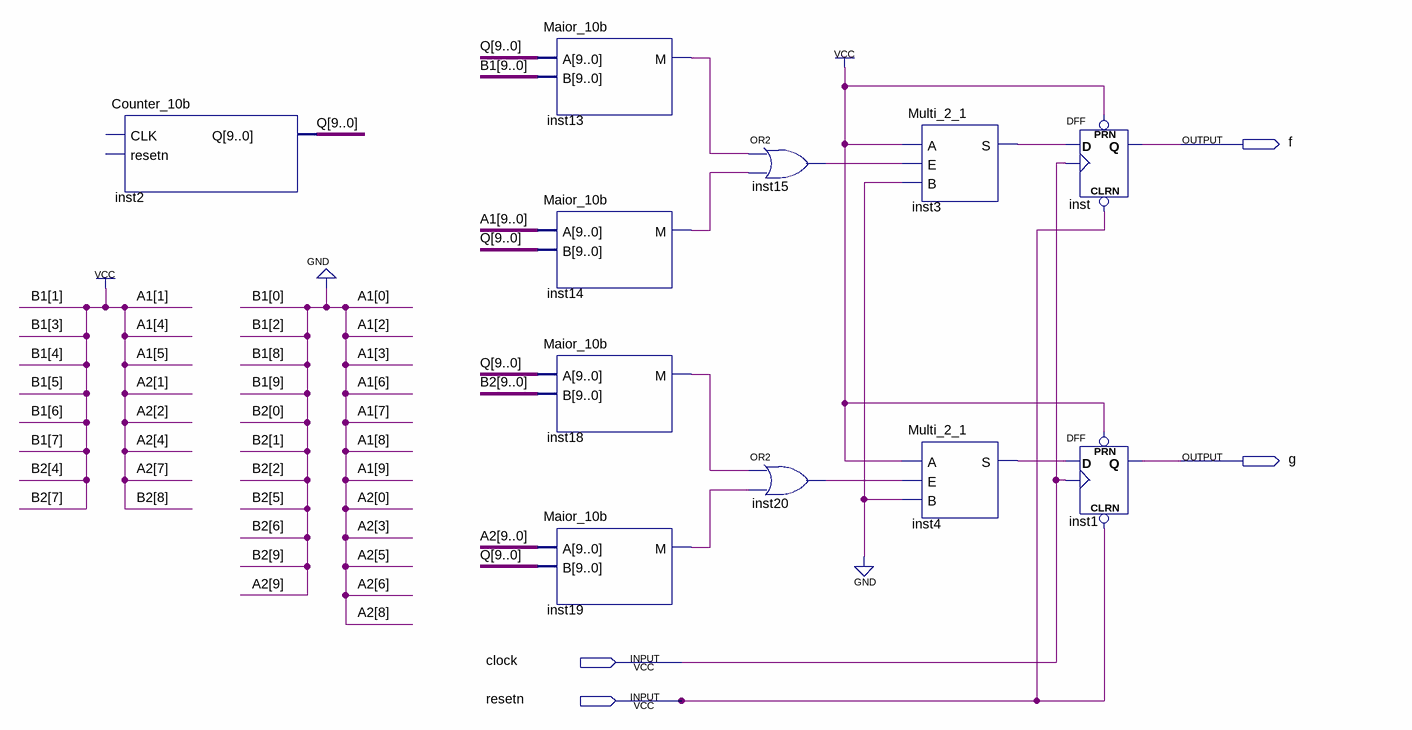
[diagram p0: schematic sheet]
// Quartus schematic Questao06.bdf as structural Verilog: 11 symbols, 4 pins
module Questao06 (
  input  clock,
  input  resetn,
  output f,
  output g
);

  wire inst3_s, inst4_s, inst13_m, inst14_m, inst15_out, inst18_m, inst19_m, inst20_out;
  wire [3:3] B2;
  wire [9:0] Q;

  Counter_10b inst2 (.Q(Q));  // open: CLK, resetn
  Maior_10b inst13 (.A(Q), .B(10'b0011111010), .M(inst13_m));
  Maior_10b inst14 (.A(10'b0000110010), .B(Q), .M(inst14_m));
  Maior_10b inst18 (.A(Q), .B({6'b011001, B2[3], 3'b000}), .M(inst18_m));
  Maior_10b inst19 (.A(10'b0010010110), .B(Q), .M(inst19_m));
  or inst15 (inst15_out, inst13_m, inst14_m);
  or inst20 (inst20_out, inst18_m, inst19_m);
  Multi_2_1 inst3 (.A(1'b1), .E(inst15_out), .B(1'b0), .S(inst3_s));
  Multi_2_1 inst4 (.A(1'b1), .E(inst20_out), .B(1'b0), .S(inst4_s));
  DFF inst (.CLRN(resetn), .CLK(clock), .D(inst3_s), .PRN(1'b1), .Q(f));
  DFF inst1 (.CLRN(resetn), .CLK(clock), .D(inst4_s), .PRN(1'b1), .Q(g));
endmodule
